# EAGLE design 10_to_6pins_converter (EAGLE 6.1)
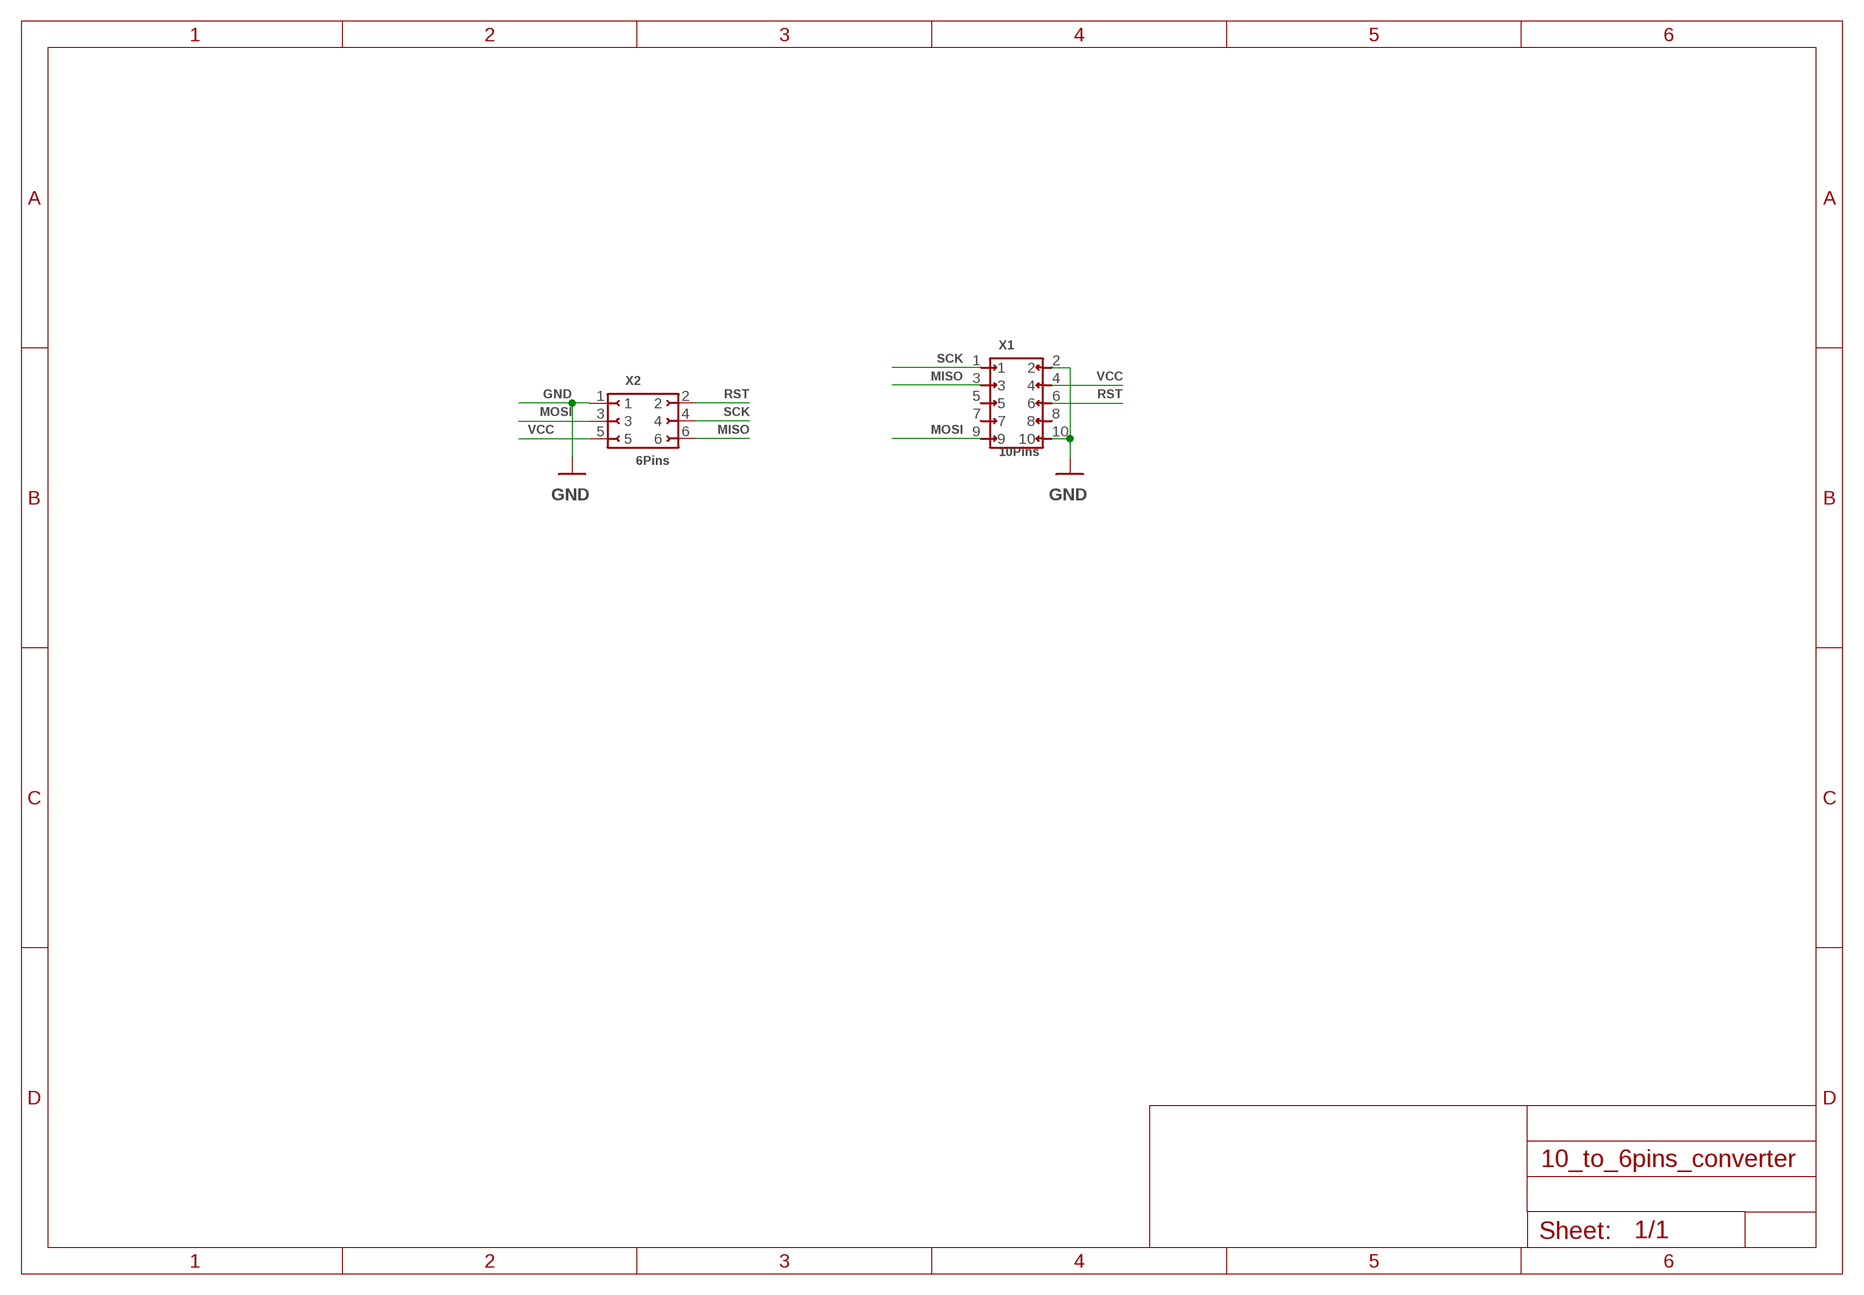
[diagram p0: schematic, sheet 1]

## Parts
X1  10Pins  PIN2X5_2.54MM_SIDE_BOARD  [PIN2X5_2.54MM_MALE_SIDE_BOARD]
X2  6Pins  PIN2X3_FEMALE2.54MM_FEMALE_SIDE_BOARD  [PIN2X3_2.54MM_FEMALE_SIDE_BOARD]

## Nets
GND: X1.2 X1.10 X2.1
MISO: X1.3 X2.6
MOSI: X1.9 X2.3
RST: X1.6 X2.2
SCK: X1.1 X2.4
VCC: X1.4 X2.5
Unconnected: X1.5 X1.7 X1.8

## Library data of the parts
X1 = __MyCommonLib1:PIN2X5
X2 = __MyCommonLib1:PIN2X3_FEMALE

## Board
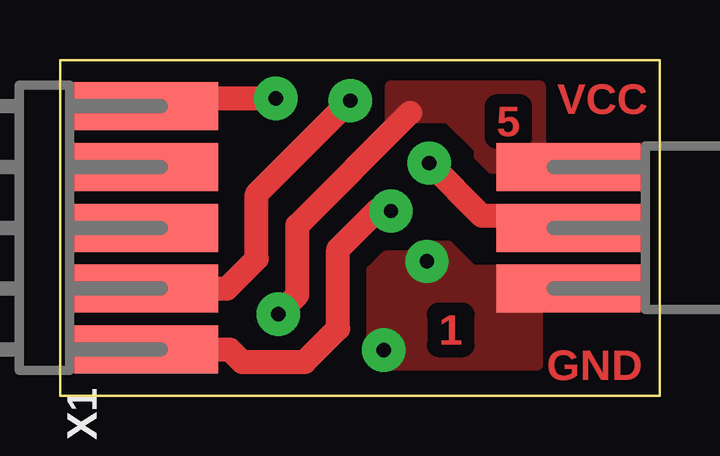
[diagram p1: board, top side]
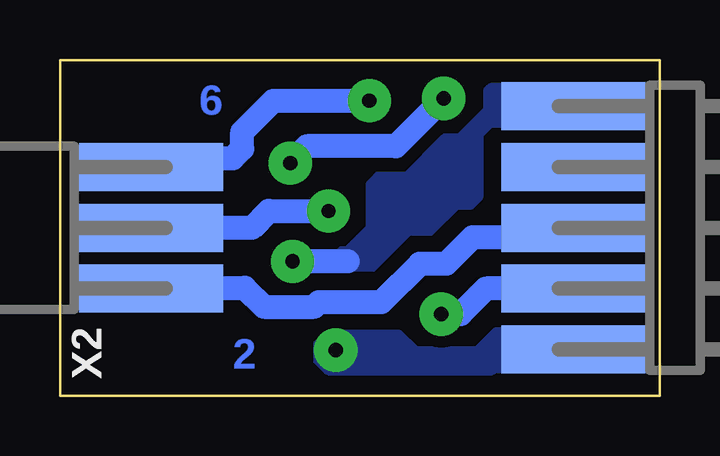
[diagram p2: board, bottom side, seen from below]

Size 25 x 14 mm. Coordinates in mm from the lower left corner, seen from the top.
Outline: 0,0 25,0 25,14 0,14 0,0
Copper layers (1*16): Top 0.035mm / dielectric 1.5mm / Bottom 0.035mm
Design rules: minimum track width 0.5mm, minimum drill 0.6mm, track to track 0.5mm, track to pad 0.5mm, pad to pad 0.5mm, via to via 0.5mm, smd to smd 0.2mm, copper to edge 0.2mm, drill to drill 1mm, minimum pad ring 10mil, minimum via ring 8mil, stop-mask expansion 4mil, vias tented up to drill 0mil, thermal gap 10mil

### Footprints (pad centres in the part's own frame; a part is rotated, then mirrored left to right if it is on the bottom)
PIN2X5_2.54MM_MALE_SIDE_BOARD = smd 2 x 6: 1 5.08,3; 3 2.54,3; 5 0,3; 7 -2.54,3; 9 -5.08,3 | smd 2 x 6 bottom: 2 5.08,3; 4 2.54,3; 6 0,3; 8 -2.54,3; 10 -5.08,3
PIN2X3_2.54MM_FEMALE_SIDE_BOARD = smd 2 x 6 bottom: 1 2.54,3; 3 0,3; 5 -2.54,3 | smd 2 x 6: 2 2.54,3; 4 0,3; 6 -2.54,3

### Placement (x,y rotation side)
X1  0.6,7 270 top
X2  24.2,7 270 bottom

### Tracks (layer width: path | path; a pad name or v marks a point on that pad's centre or on a via)
GND  (via drill 0.6 pad 1.8)
  Bottom 1: 3.62,1.9 X1.2 3.92,1.6 | 13,5.6 v15.3,5.6 | X1.10 4.08,11.6
  other vias: 13.5,1.9
  pour Top (no thermals): 13.2,1.3 19.9,1.3 19.9,4.7 19.9,5.2 17.2,5.2 16.2,6.2 15,6.2 14.6,5.8 13.6,5.8 13,5.2 13,1.5
  pour Bottom (no thermals): 3.5,2.6 6.8,2.6 7.6,1.8 10.2,1.8 10.9,2.5 13.8,2.5 14.2,2.1 14.2,1.5 13.8,1.1 7,1.1 6.9,1.2 3.5,1.2
  pour Bottom (no thermals): 7.1,11.4 7.6,10.9 7.6,8.3 7.9,8 8.5,8 9.6,6.9 10.5,6.9 12,5.4 13.4,5.4 13.4,5.8 13.2,6 13,6 12,7 12,8.8 11.7,9.1 10.5,9.1 8.9,10.7 8.3,10.7 7.1,11.9 7.1,12.7 7,12.8 4.7,12.8 4.7,11.4
MISO  (via drill 0.6 pad 1.8)
  Top 1: X1.3 6.96,4.46 8.2,5.7 8.2,8.4 v12.1,12.3
  Bottom 1: X2.6 19,9.54 18.64,9.9 17.8,9.9 17.4,10.3 17.4,11 16.1,12.3 v12.1,12.3
MOSI  (via drill 0.6 pad 1.8)
  Top 1: 3.6,12.1 X1.9 3.92,12.4 v9,12.4 | v15.4,9.7 17.6,7.5 20.7,7.5 X2.3
  Bottom 1: v9,12.4 11,10.4 14.7,10.4 v15.4,9.7
RST
  Bottom 1: X1.6 4,6.6 7.8,6.6 8.9,5.5 10,5.5 11.6,3.9 14.2,3.9 14.4,3.7 16.5,3.7 17.3,4.5 21.16,4.5 X2.2
SCK  (via drill 0.6 pad 1.8)
  Top 1: X1.1 7.08,1.92 7.6,1.4 10.2,1.4 11.6,2.8 11.6,6.1 13.2,7.7 v13.8,7.7
  Bottom 1: X2.4 17,7 16.3,7.7 v13.8,7.7
VCC  (via drill 0.6 pad 1.8)
  Top 1: 21.14,9.6 X2.5 21.16,9.5 19.2,9.5 19,9.7 | v9.1,3.4 9.9,4.2 9.9,7.1 14.6,11.8
  Bottom 1: X1.4 7.24,4.46 8.3,3.4 v9.1,3.4
  pour Top (no thermals): 13.8,11.2 13.8,12.9 20,12.9 20,9.6 19.9,9.5 18,9.5 17.5,10 17.5,10.3 16.2,11.6 14.6,11.6 14.2,11.2

### Text on the board
Top: VCC | 5 | 1 | GND
Bottom: 6 | 2